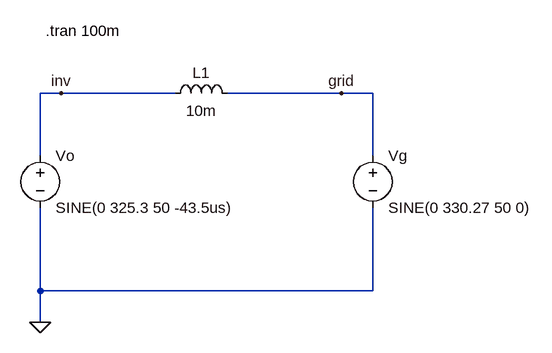
[diagram p0: schematic Test1 - sin.asc]
Test1 - sin.asc, the LTspice schematic file:
Version 4
SHEET 1 880 680
WIRE 64 48 32 48
WIRE 240 48 64 48
WIRE 496 48 320 48
WIRE 544 48 496 48
WIRE 32 144 32 48
WIRE 544 144 544 48
WIRE 32 352 32 224
WIRE 544 352 544 224
WIRE 544 352 32 352
WIRE 32 400 32 352
FLAG 32 400 0
FLAG 64 48 inv
FLAG 496 48 grid
SYMBOL voltage 32 128 R0
WINDOW 123 0 0 Left 0
WINDOW 39 0 0 Left 0
SYMATTR InstName Vo
SYMATTR Value SINE(0 325.3 50 -43.5us)
SYMBOL voltage 544 128 R0
WINDOW 123 0 0 Left 0
WINDOW 39 0 0 Left 0
SYMATTR InstName Vg
SYMATTR Value SINE(0 330.27 50 0)
SYMBOL ind 224 64 R270
WINDOW 0 32 56 VTop 2
WINDOW 3 5 56 VBottom 2
SYMATTR InstName L1
SYMATTR Value 10m
TEXT 40 -48 Left 2 !.tran 100m

The netlist it stands for:
* Test1 - sin.asc
Vo inv 0 SINE(0 325.3 50 -43.5us)
Vg grid 0 SINE(0 330.27 50 0)
L1 inv grid 10m
.tran 100m
.backanno
.end